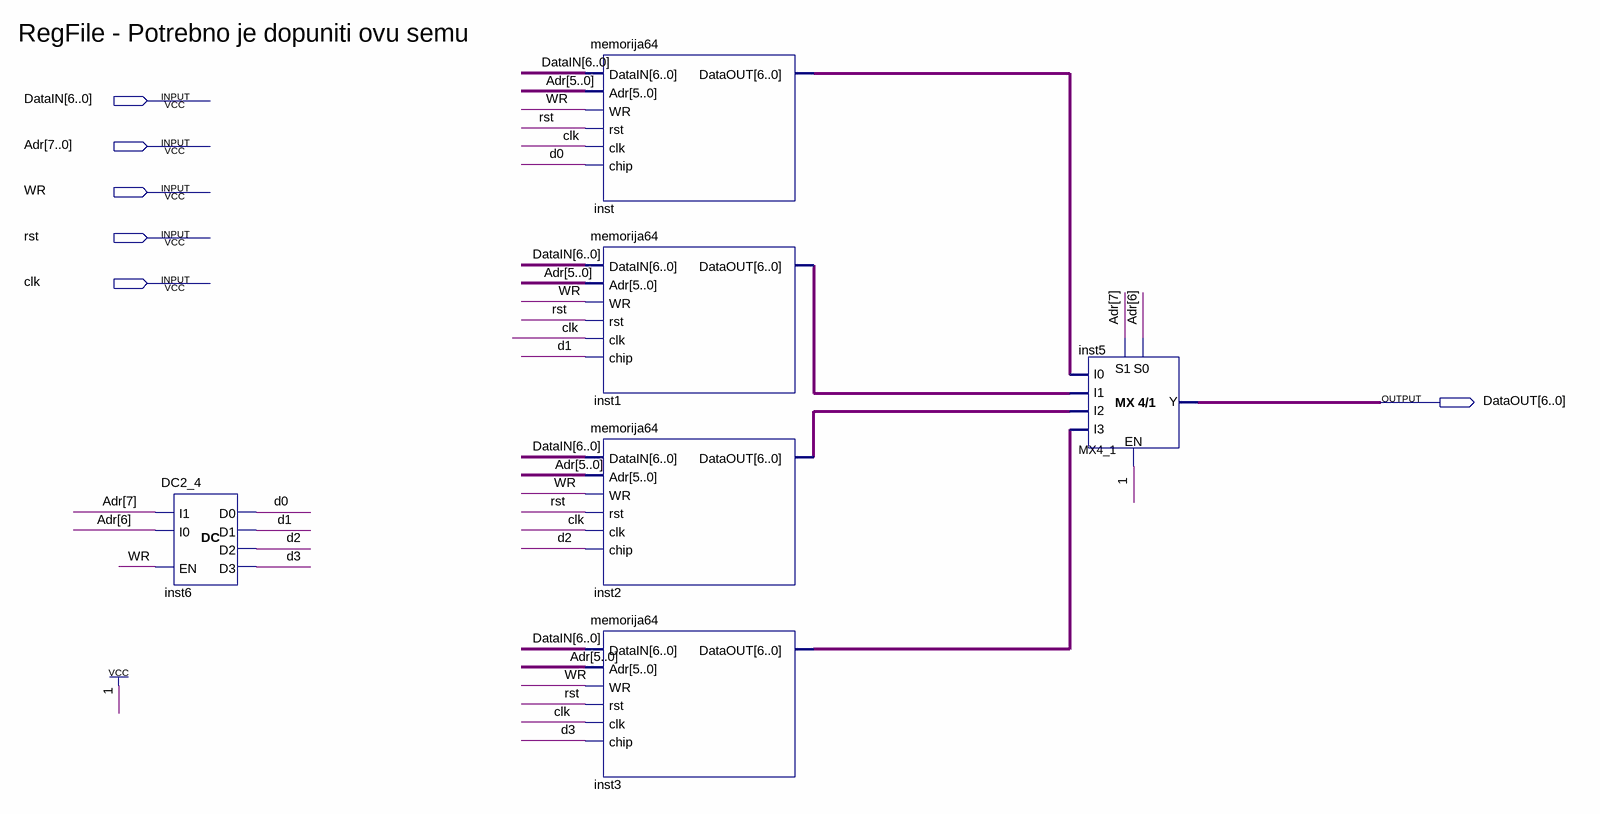
[diagram p0: schematic sheet]
// Quartus schematic RegFile.bdf as structural Verilog: 6 symbols, 6 pins
module RegFile (
  input  [6:0] DataIN,
  input  [7:0] Adr,
  input  WR,
  input  rst,
  input  clk,
  output [6:0] DataOUT
);

  wire d0, d1, d2, d3;
  wire [6:0] inst1_dataout, inst2_dataout, inst3_dataout, inst_dataout;

  DC2_4 inst6 (.I0(Adr[6]), .I1(Adr[7]), .EN(WR), .D0(d0), .D1(d1), .D2(d2), .D3(d3));
  memorija64 inst (.DataIN(DataIN), .Adr(Adr[5:0]), .WR(WR), .rst(rst), .clk(clk), .chip(d0), .DataOUT(inst_dataout));
  memorija64 inst1 (.DataIN(DataIN), .Adr(Adr[5:0]), .WR(WR), .rst(rst), .clk(clk), .chip(d1), .DataOUT(inst1_dataout));
  memorija64 inst2 (.DataIN(DataIN), .Adr(Adr[5:0]), .WR(WR), .rst(rst), .clk(clk), .chip(d2), .DataOUT(inst2_dataout));
  memorija64 inst3 (.DataIN(DataIN), .Adr(Adr[5:0]), .WR(WR), .rst(rst), .clk(clk), .chip(d3), .DataOUT(inst3_dataout));
  MX4_1 inst5 (
    .S1(Adr[7]), .S0(Adr[6]), .EN(1'b1), .I3(inst3_dataout), .I2(inst2_dataout), .I1(inst1_dataout),
    .I0(inst_dataout), .Y(DataOUT));

  // Notes on the sheet:
  //   RegFile - Potrebno je dopuniti ovu semu
endmodule
